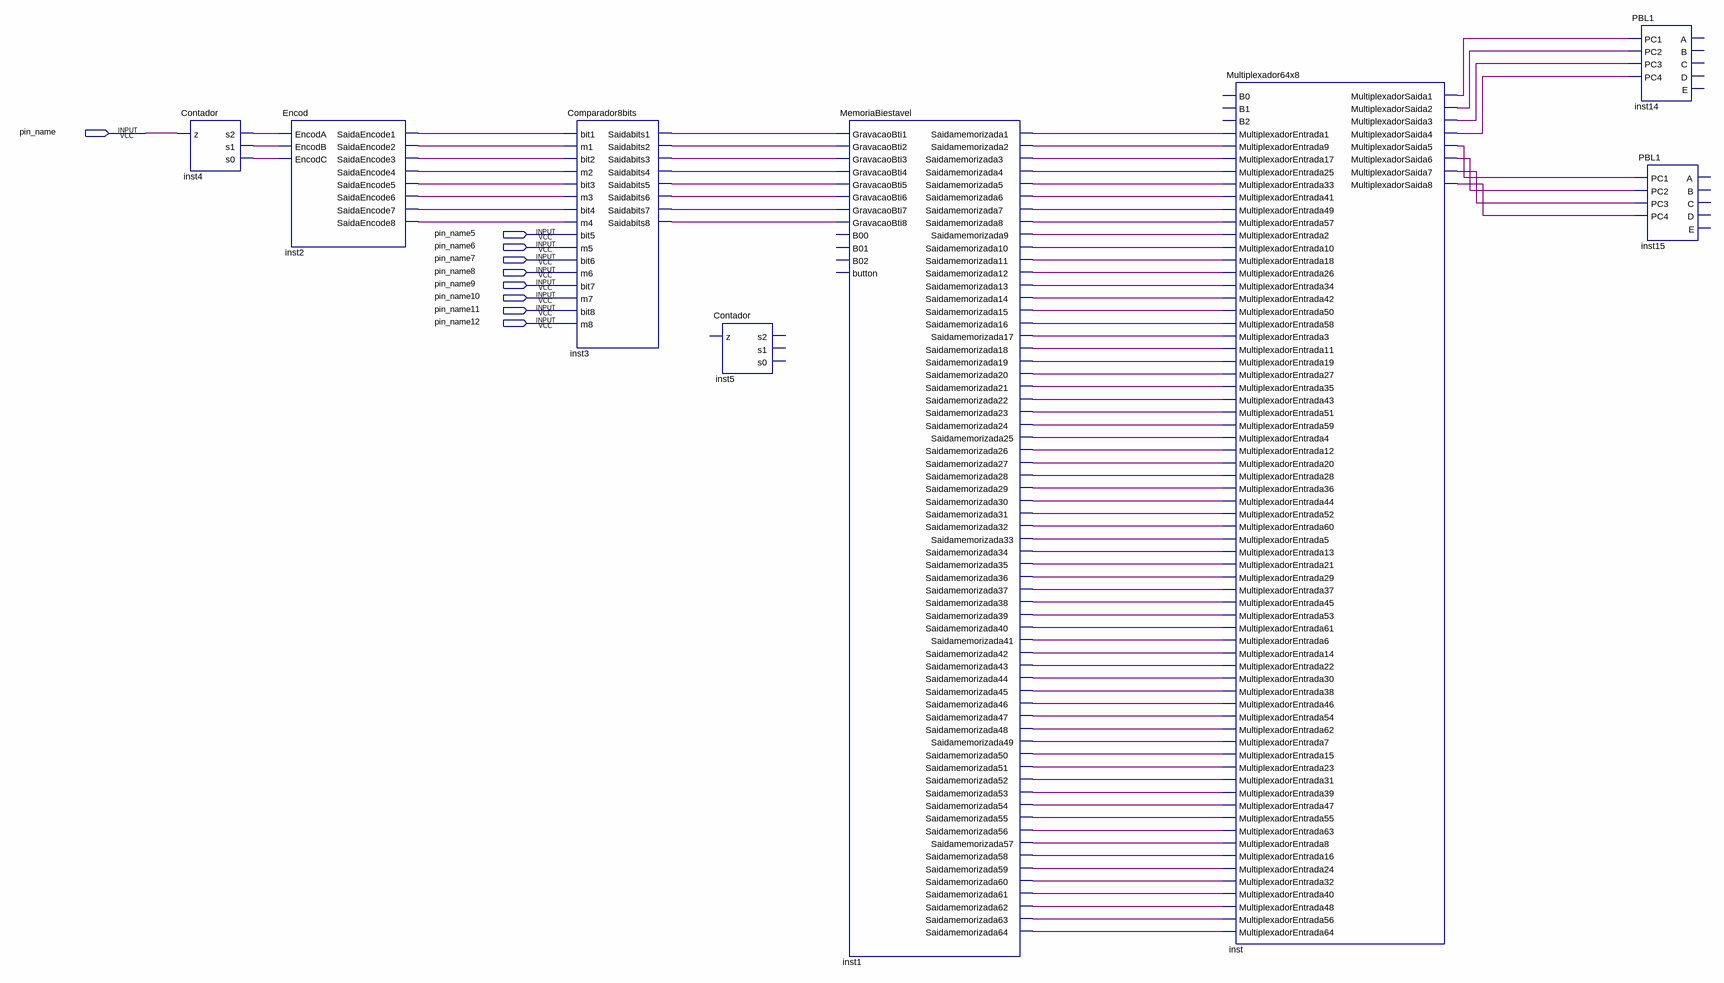
[diagram p0: schematic sheet]
// Quartus schematic ComoVaiFicar.bdf as structural Verilog: 8 symbols, 9 pins
module ComoVaiFicar (
  input  pin_name,
  input  pin_name5,
  input  pin_name6,
  input  pin_name7,
  input  pin_name8,
  input  pin_name9,
  input  pin_name10,
  input  pin_name11,
  input  pin_name12
);

  wire inst1_saidamemorizada1, inst1_saidamemorizada2, inst1_saidamemorizada3, inst1_saidamemorizada4,
       inst1_saidamemorizada5, inst1_saidamemorizada6, inst1_saidamemorizada7, inst1_saidamemorizada8,
       inst1_saidamemorizada9, inst1_saidamemorizada10, inst1_saidamemorizada11, inst1_saidamemorizada12,
       inst1_saidamemorizada13, inst1_saidamemorizada14, inst1_saidamemorizada15, inst1_saidamemorizada16,
       inst1_saidamemorizada17, inst1_saidamemorizada18, inst1_saidamemorizada19, inst1_saidamemorizada20,
       inst1_saidamemorizada21, inst1_saidamemorizada22, inst1_saidamemorizada23, inst1_saidamemorizada24,
       inst1_saidamemorizada25, inst1_saidamemorizada26, inst1_saidamemorizada27, inst1_saidamemorizada28,
       inst1_saidamemorizada29, inst1_saidamemorizada30, inst1_saidamemorizada31, inst1_saidamemorizada32,
       inst1_saidamemorizada33, inst1_saidamemorizada34, inst1_saidamemorizada35, inst1_saidamemorizada36,
       inst1_saidamemorizada37, inst1_saidamemorizada38, inst1_saidamemorizada39, inst1_saidamemorizada40,
       inst1_saidamemorizada41, inst1_saidamemorizada42, inst1_saidamemorizada43, inst1_saidamemorizada44,
       inst1_saidamemorizada45, inst1_saidamemorizada46, inst1_saidamemorizada47, inst1_saidamemorizada48,
       inst1_saidamemorizada49, inst1_saidamemorizada50, inst1_saidamemorizada51, inst1_saidamemorizada52,
       inst1_saidamemorizada53, inst1_saidamemorizada54, inst1_saidamemorizada55, inst1_saidamemorizada56,
       inst1_saidamemorizada57, inst1_saidamemorizada58, inst1_saidamemorizada59, inst1_saidamemorizada60,
       inst1_saidamemorizada61, inst1_saidamemorizada62, inst1_saidamemorizada63, inst1_saidamemorizada64,
       inst2_saidaencode1, inst2_saidaencode2, inst2_saidaencode3, inst2_saidaencode4, inst2_saidaencode5,
       inst2_saidaencode6, inst2_saidaencode7, inst2_saidaencode8, inst3_saidabits1, inst3_saidabits2,
       inst3_saidabits3, inst3_saidabits4, inst3_saidabits5, inst3_saidabits6, inst3_saidabits7,
       inst3_saidabits8, inst4_s0, inst4_s1, inst4_s2, inst_multiplexadorsaida1, inst_multiplexadorsaida2,
       inst_multiplexadorsaida3, inst_multiplexadorsaida4, inst_multiplexadorsaida5,
       inst_multiplexadorsaida6, inst_multiplexadorsaida7, inst_multiplexadorsaida8;

  Contador inst4 (.z(pin_name), .s0(inst4_s0), .s2(inst4_s2), .s1(inst4_s1));
  Encod inst2 (
    .EncodA(inst4_s2), .EncodB(inst4_s1), .EncodC(inst4_s0), .SaidaEncode1(inst2_saidaencode1),
    .SaidaEncode2(inst2_saidaencode2), .SaidaEncode3(inst2_saidaencode3), .SaidaEncode4(inst2_saidaencode4),
    .SaidaEncode5(inst2_saidaencode5), .SaidaEncode6(inst2_saidaencode6), .SaidaEncode7(inst2_saidaencode7),
    .SaidaEncode8(inst2_saidaencode8));
  Comparador8bits inst3 (
    .bit1(inst2_saidaencode1), .m1(inst2_saidaencode2), .bit2(inst2_saidaencode3), .m2(inst2_saidaencode4),
    .bit3(inst2_saidaencode5), .m3(inst2_saidaencode6), .bit4(inst2_saidaencode7), .m4(inst2_saidaencode8),
    .bit5(pin_name5), .m5(pin_name6), .bit6(pin_name7), .m6(pin_name8), .bit7(pin_name9), .m7(pin_name10),
    .bit8(pin_name11), .m8(pin_name12), .Saidabits1(inst3_saidabits1), .Saidabits2(inst3_saidabits2),
    .Saidabits3(inst3_saidabits3), .Saidabits4(inst3_saidabits4), .Saidabits5(inst3_saidabits5),
    .Saidabits6(inst3_saidabits6), .Saidabits7(inst3_saidabits7), .Saidabits8(inst3_saidabits8));
  Contador inst5 ();  // open: z, s0, s2, s1
  MemoriaBiestavel inst1 (
    .GravacaoBti1(inst3_saidabits1), .GravacaoBti2(inst3_saidabits2), .GravacaoBti3(inst3_saidabits3),
    .GravacaoBti4(inst3_saidabits4), .GravacaoBti5(inst3_saidabits5), .GravacaoBti6(inst3_saidabits6),
    .GravacaoBti7(inst3_saidabits7), .GravacaoBti8(inst3_saidabits8),
    .Saidamemorizada1(inst1_saidamemorizada1), .Saidamemorizada19(inst1_saidamemorizada19),
    .Saidamemorizada28(inst1_saidamemorizada28), .Saidamemorizada37(inst1_saidamemorizada37),
    .Saidamemorizada46(inst1_saidamemorizada46), .Saidamemorizada64(inst1_saidamemorizada64),
    .Saidamemorizada2(inst1_saidamemorizada2), .Saidamemorizada3(inst1_saidamemorizada3),
    .Saidamemorizada4(inst1_saidamemorizada4), .Saidamemorizada5(inst1_saidamemorizada5),
    .Saidamemorizada6(inst1_saidamemorizada6), .Saidamemorizada7(inst1_saidamemorizada7),
    .Saidamemorizada8(inst1_saidamemorizada8), .Saidamemorizada9(inst1_saidamemorizada9),
    .Saidamemorizada10(inst1_saidamemorizada10), .Saidamemorizada11(inst1_saidamemorizada11),
    .Saidamemorizada12(inst1_saidamemorizada12), .Saidamemorizada13(inst1_saidamemorizada13),
    .Saidamemorizada14(inst1_saidamemorizada14), .Saidamemorizada15(inst1_saidamemorizada15),
    .Saidamemorizada16(inst1_saidamemorizada16), .Saidamemorizada17(inst1_saidamemorizada17),
    .Saidamemorizada18(inst1_saidamemorizada18), .Saidamemorizada20(inst1_saidamemorizada20),
    .Saidamemorizada21(inst1_saidamemorizada21), .Saidamemorizada22(inst1_saidamemorizada22),
    .Saidamemorizada23(inst1_saidamemorizada23), .Saidamemorizada24(inst1_saidamemorizada24),
    .Saidamemorizada25(inst1_saidamemorizada25), .Saidamemorizada26(inst1_saidamemorizada26),
    .Saidamemorizada27(inst1_saidamemorizada27), .Saidamemorizada29(inst1_saidamemorizada29),
    .Saidamemorizada30(inst1_saidamemorizada30), .Saidamemorizada31(inst1_saidamemorizada31),
    .Saidamemorizada63(inst1_saidamemorizada63), .Saidamemorizada62(inst1_saidamemorizada62),
    .Saidamemorizada61(inst1_saidamemorizada61), .Saidamemorizada60(inst1_saidamemorizada60),
    .Saidamemorizada32(inst1_saidamemorizada32), .Saidamemorizada33(inst1_saidamemorizada33),
    .Saidamemorizada34(inst1_saidamemorizada34), .Saidamemorizada35(inst1_saidamemorizada35),
    .Saidamemorizada36(inst1_saidamemorizada36), .Saidamemorizada38(inst1_saidamemorizada38),
    .Saidamemorizada39(inst1_saidamemorizada39), .Saidamemorizada40(inst1_saidamemorizada40),
    .Saidamemorizada41(inst1_saidamemorizada41), .Saidamemorizada42(inst1_saidamemorizada42),
    .Saidamemorizada43(inst1_saidamemorizada43), .Saidamemorizada44(inst1_saidamemorizada44),
    .Saidamemorizada45(inst1_saidamemorizada45), .Saidamemorizada47(inst1_saidamemorizada47),
    .Saidamemorizada48(inst1_saidamemorizada48), .Saidamemorizada49(inst1_saidamemorizada49),
    .Saidamemorizada50(inst1_saidamemorizada50), .Saidamemorizada51(inst1_saidamemorizada51),
    .Saidamemorizada52(inst1_saidamemorizada52), .Saidamemorizada53(inst1_saidamemorizada53),
    .Saidamemorizada54(inst1_saidamemorizada54), .Saidamemorizada55(inst1_saidamemorizada55),
    .Saidamemorizada56(inst1_saidamemorizada56), .Saidamemorizada57(inst1_saidamemorizada57),
    .Saidamemorizada58(inst1_saidamemorizada58), .Saidamemorizada59(inst1_saidamemorizada59));  // open: B00, B01, B02, button
  Multiplexador64x8 inst (
    .MultiplexadorEntrada1(inst1_saidamemorizada1), .MultiplexadorEntrada10(inst1_saidamemorizada10),
    .MultiplexadorEntrada19(inst1_saidamemorizada19), .MultiplexadorEntrada28(inst1_saidamemorizada28),
    .MultiplexadorEntrada37(inst1_saidamemorizada37), .MultiplexadorEntrada46(inst1_saidamemorizada46),
    .MultiplexadorEntrada64(inst1_saidamemorizada64), .MultiplexadorEntrada9(inst1_saidamemorizada2),
    .MultiplexadorEntrada17(inst1_saidamemorizada3), .MultiplexadorEntrada25(inst1_saidamemorizada4),
    .MultiplexadorEntrada33(inst1_saidamemorizada5), .MultiplexadorEntrada41(inst1_saidamemorizada6),
    .MultiplexadorEntrada49(inst1_saidamemorizada7), .MultiplexadorEntrada57(inst1_saidamemorizada8),
    .MultiplexadorEntrada2(inst1_saidamemorizada9), .MultiplexadorEntrada18(inst1_saidamemorizada11),
    .MultiplexadorEntrada26(inst1_saidamemorizada12), .MultiplexadorEntrada34(inst1_saidamemorizada13),
    .MultiplexadorEntrada42(inst1_saidamemorizada14), .MultiplexadorEntrada50(inst1_saidamemorizada15),
    .MultiplexadorEntrada58(inst1_saidamemorizada16), .MultiplexadorEntrada3(inst1_saidamemorizada17),
    .MultiplexadorEntrada11(inst1_saidamemorizada18), .MultiplexadorEntrada27(inst1_saidamemorizada20),
    .MultiplexadorEntrada35(inst1_saidamemorizada21), .MultiplexadorEntrada43(inst1_saidamemorizada22),
    .MultiplexadorEntrada51(inst1_saidamemorizada23), .MultiplexadorEntrada59(inst1_saidamemorizada24),
    .MultiplexadorEntrada4(inst1_saidamemorizada25), .MultiplexadorEntrada12(inst1_saidamemorizada26),
    .MultiplexadorEntrada20(inst1_saidamemorizada27), .MultiplexadorEntrada36(inst1_saidamemorizada29),
    .MultiplexadorEntrada44(inst1_saidamemorizada30), .MultiplexadorEntrada52(inst1_saidamemorizada31),
    .MultiplexadorEntrada60(inst1_saidamemorizada32), .MultiplexadorEntrada5(inst1_saidamemorizada33),
    .MultiplexadorEntrada13(inst1_saidamemorizada34), .MultiplexadorEntrada21(inst1_saidamemorizada35),
    .MultiplexadorEntrada29(inst1_saidamemorizada36), .MultiplexadorEntrada45(inst1_saidamemorizada38),
    .MultiplexadorEntrada53(inst1_saidamemorizada39), .MultiplexadorEntrada61(inst1_saidamemorizada40),
    .MultiplexadorEntrada6(inst1_saidamemorizada41), .MultiplexadorEntrada14(inst1_saidamemorizada42),
    .MultiplexadorEntrada22(inst1_saidamemorizada43), .MultiplexadorEntrada30(inst1_saidamemorizada44),
    .MultiplexadorEntrada38(inst1_saidamemorizada45), .MultiplexadorEntrada54(inst1_saidamemorizada47),
    .MultiplexadorEntrada62(inst1_saidamemorizada48), .MultiplexadorEntrada7(inst1_saidamemorizada49),
    .MultiplexadorEntrada15(inst1_saidamemorizada50), .MultiplexadorEntrada23(inst1_saidamemorizada51),
    .MultiplexadorEntrada31(inst1_saidamemorizada52), .MultiplexadorEntrada39(inst1_saidamemorizada53),
    .MultiplexadorEntrada47(inst1_saidamemorizada54), .MultiplexadorEntrada55(inst1_saidamemorizada55),
    .MultiplexadorEntrada63(inst1_saidamemorizada56), .MultiplexadorEntrada8(inst1_saidamemorizada57),
    .MultiplexadorEntrada16(inst1_saidamemorizada58), .MultiplexadorEntrada24(inst1_saidamemorizada59),
    .MultiplexadorEntrada32(inst1_saidamemorizada60), .MultiplexadorEntrada40(inst1_saidamemorizada61),
    .MultiplexadorEntrada48(inst1_saidamemorizada62), .MultiplexadorEntrada56(inst1_saidamemorizada63),
    .MultiplexadorSaida1(inst_multiplexadorsaida1), .MultiplexadorSaida2(inst_multiplexadorsaida2),
    .MultiplexadorSaida3(inst_multiplexadorsaida3), .MultiplexadorSaida4(inst_multiplexadorsaida4),
    .MultiplexadorSaida5(inst_multiplexadorsaida5), .MultiplexadorSaida6(inst_multiplexadorsaida6),
    .MultiplexadorSaida7(inst_multiplexadorsaida7), .MultiplexadorSaida8(inst_multiplexadorsaida8));  // open: B0, B1, B2
  PBL1 inst14 (
    .PC1(inst_multiplexadorsaida1), .PC2(inst_multiplexadorsaida2), .PC3(inst_multiplexadorsaida3),
    .PC4(inst_multiplexadorsaida4));  // open: A, B, C, D, E
  PBL1 inst15 (
    .PC1(inst_multiplexadorsaida5), .PC2(inst_multiplexadorsaida6), .PC3(inst_multiplexadorsaida7),
    .PC4(inst_multiplexadorsaida8));  // open: A, B, C, D, E
endmodule
